# Altium schematic sheet GALX4-0047N_PCB-1109N_REV-A_io_1.SchDoc
size 431 x 279 mm; SheetNumber: 1; SheetTotal: 1; DocumentName: Sheet1.SCHDOC
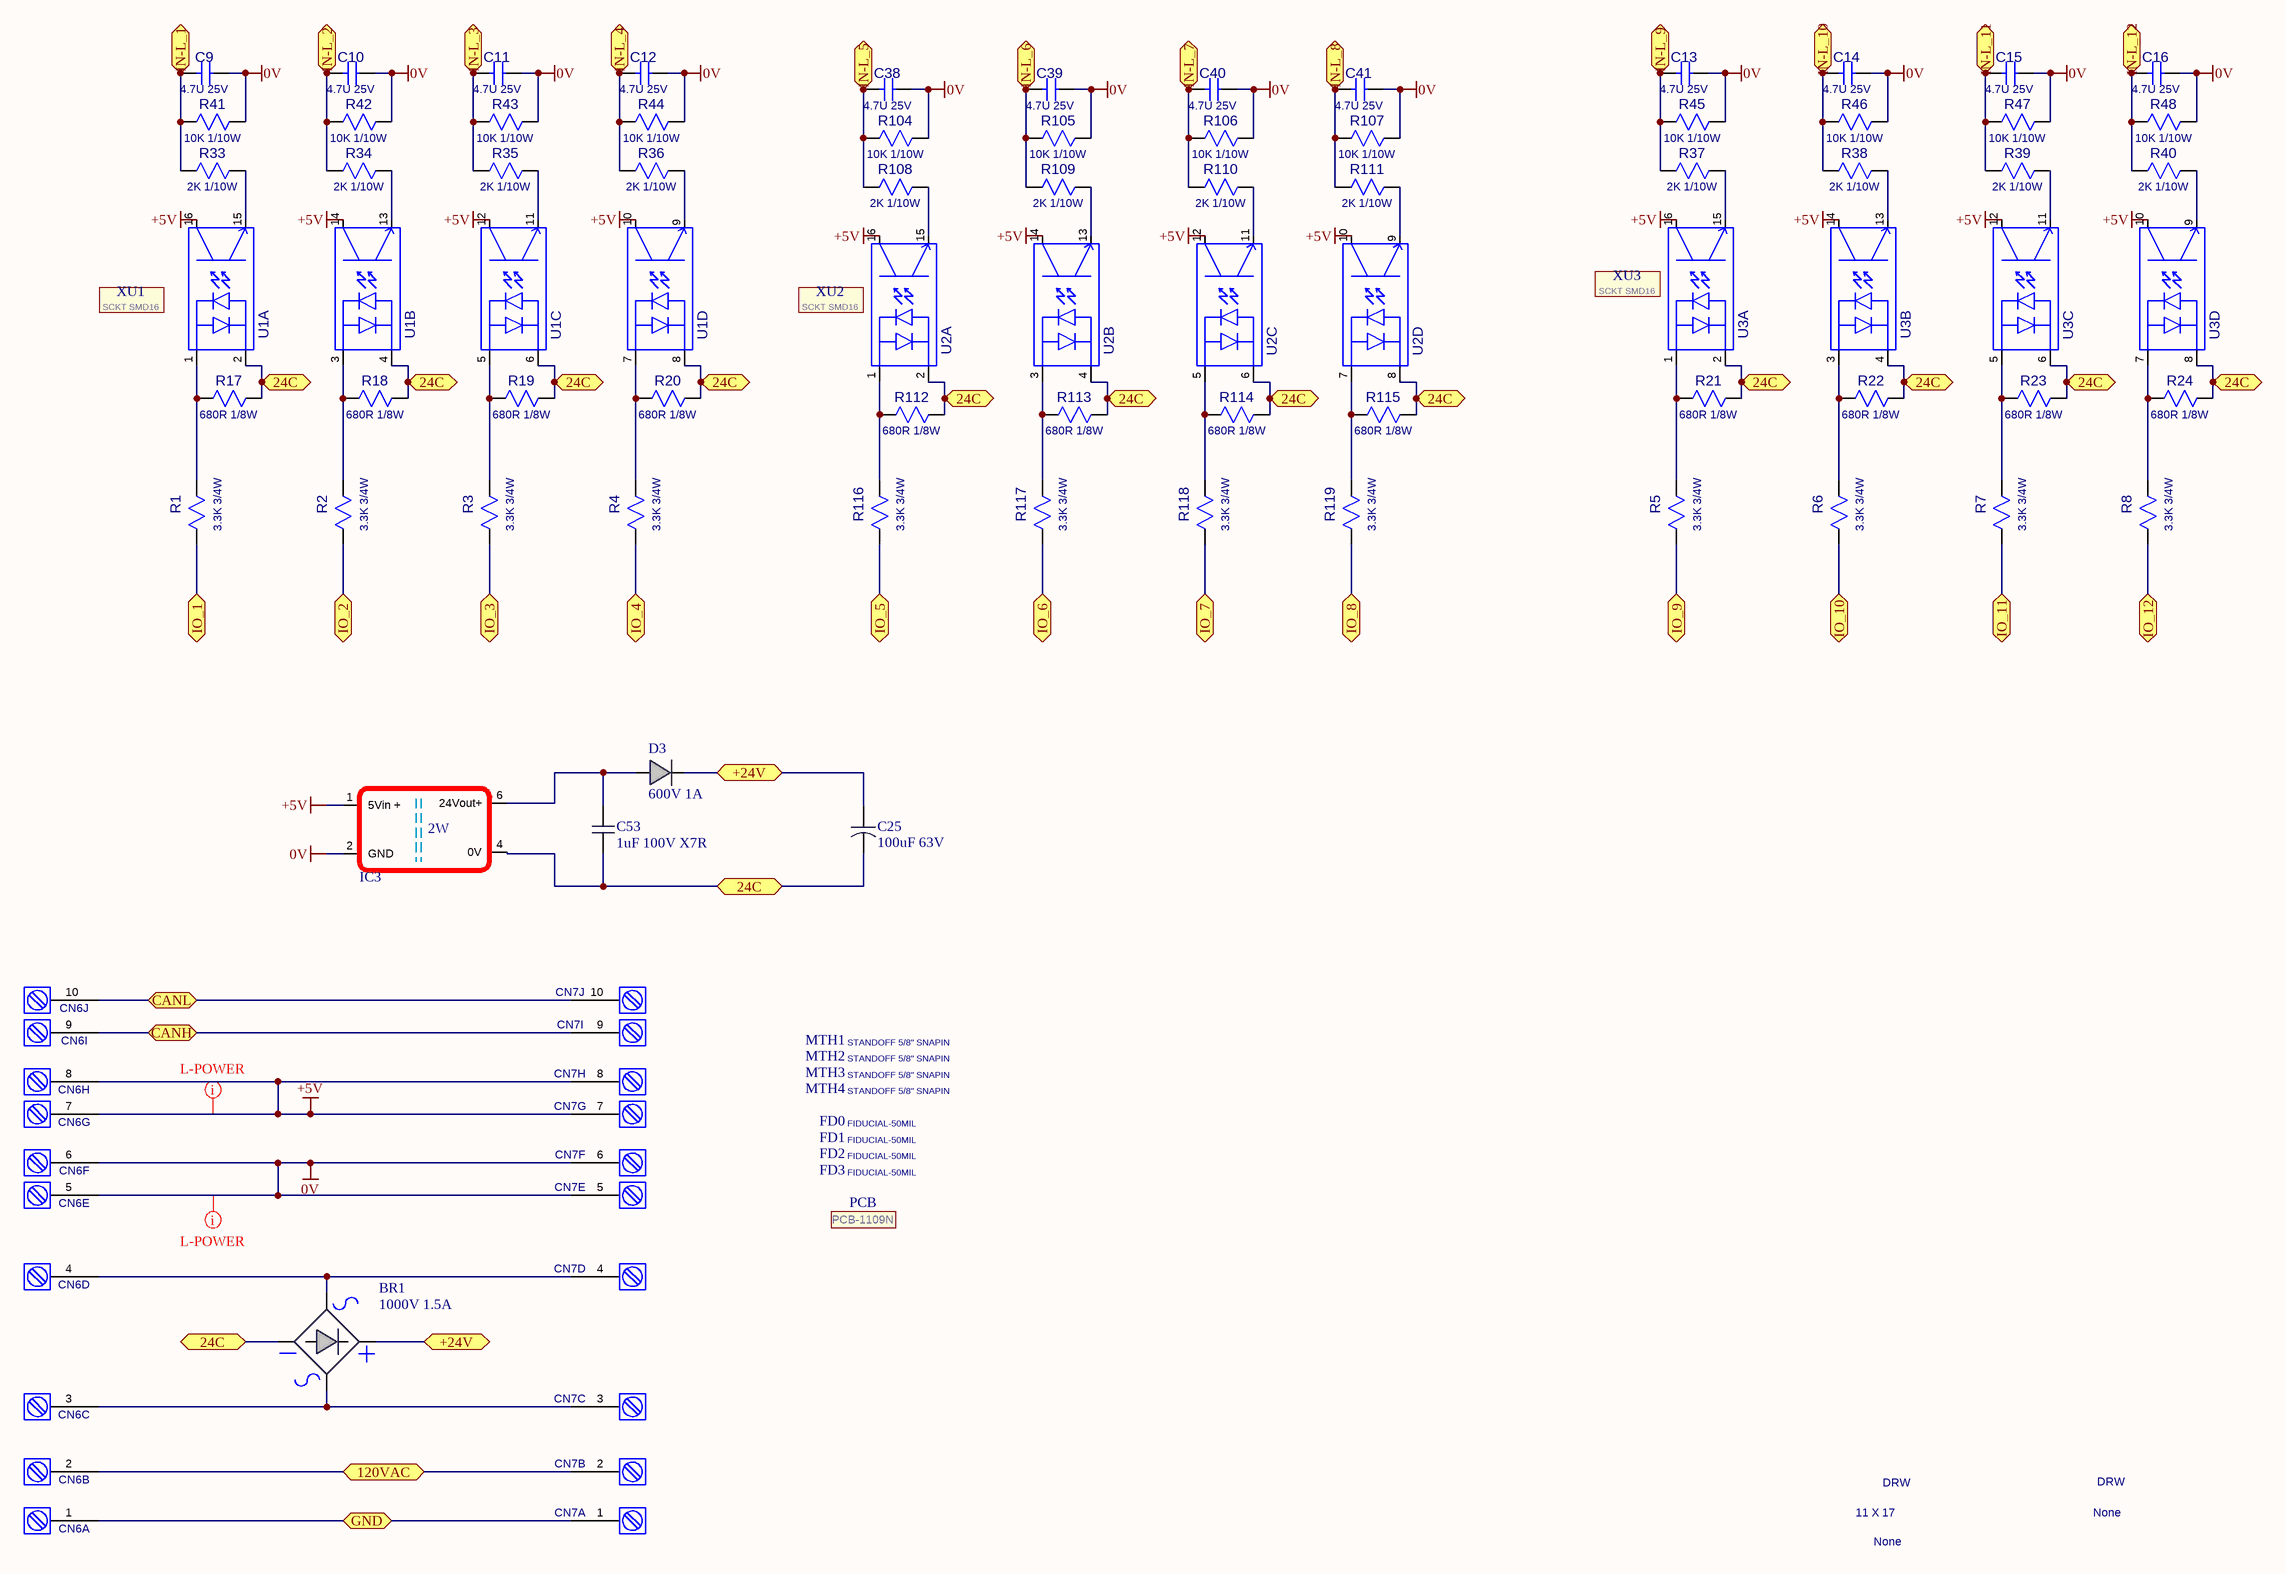
[diagram p0: GALX4-0047N_PCB-1109N_REV-A_io_1.SchDoc]

## Parts
BR1  1000V 1.5A  [SDIP4]
C9  value 4.7U 25V  [0805]  (hidden comment: CAP-0098N)
C10  value 4.7U 25V  [0805]  (hidden comment: CAP-0098N)
C11  value 4.7U 25V  [0805]  (hidden comment: CAP-0098N)
C12  value 4.7U 25V  [0805]  (hidden comment: CAP-0098N)
C13  value 4.7U 25V  [0805]  (hidden comment: CAP-0098N)
C14  value 4.7U 25V  [0805]  (hidden comment: CAP-0098N)
C15  value 4.7U 25V  [0805]  (hidden comment: CAP-0098N)
C16  value 4.7U 25V  [0805]  (hidden comment: CAP-0098N)
C25  100uF 63V  [D10.3]
C38  value 4.7U 25V  [0805]  (hidden comment: CAP-0098N)
C39  value 4.7U 25V  [0805]  (hidden comment: CAP-0098N)
C40  value 4.7U 25V  [0805]  (hidden comment: CAP-0098N)
C41  value 4.7U 25V  [0805]  (hidden comment: CAP-0098N)
C53  1uF 100V X7R  [1206 - CAP]
CN6  CONN-0193N  [CN_150_10P_VERT]  (value not drawn)  (parts A,B,C,D,E,F,G,H,I,J of 10)
CN7  CONN-0193N  [CN_150_10P_VERT]  (value not drawn)  (parts A,B,C,D,E,F,G,H,I,J of 10)
D3  600V 1A  [SMA]
FD0  FIDUCIAL-50MIL  [FIDUCIAL-50MIL]  (no BOM)
FD1  FIDUCIAL-50MIL  [FIDUCIAL-50MIL]  (no BOM)
FD2  FIDUCIAL-50MIL  [FIDUCIAL-50MIL]  (no BOM)
FD3  FIDUCIAL-50MIL  [FIDUCIAL-50MIL]  (no BOM)
IC3  PDM2-S5-S24-S  [PDM2-S5-S24-S]  (value not drawn)
MTH1  value STANDOFF 5/8" SNAPIN  [STANDOFF-8-5/8"]  (hidden comment: HWPC-0018N)
MTH2  value STANDOFF 5/8" SNAPIN  [STANDOFF-8-5/8"]  (hidden comment: HWPC-0018N)
MTH3  value STANDOFF 5/8" SNAPIN  [STANDOFF-8-5/8"]  (hidden comment: HWPC-0018N)
MTH4  value STANDOFF 5/8" SNAPIN  [STANDOFF-8-5/8"]  (hidden comment: HWPC-0018N)
PCB  GAL P/N: PCB-1109N  (hidden comment: PCB)  (mechanical)
R1  value 3.3K 3/4W  [2010]  (hidden comment: RES-0348N)
R2  value 3.3K 3/4W  [2010]  (hidden comment: RES-0348N)
R3  value 3.3K 3/4W  [2010]  (hidden comment: RES-0348N)
R4  value 3.3K 3/4W  [2010]  (hidden comment: RES-0348N)
R5  value 3.3K 3/4W  [2010]  (hidden comment: RES-0348N)
R6  value 3.3K 3/4W  [2010]  (hidden comment: RES-0348N)
R7  value 3.3K 3/4W  [2010]  (hidden comment: RES-0348N)
R8  value 3.3K 3/4W  [2010]  (hidden comment: RES-0348N)
R17  value 680R 1/8W  [0805]  (hidden comment: RES-0338N)
R18  value 680R 1/8W  [0805]  (hidden comment: RES-0338N)
R19  value 680R 1/8W  [0805]  (hidden comment: RES-0338N)
R20  value 680R 1/8W  [0805]  (hidden comment: RES-0338N)
R21  value 680R 1/8W  [0805]  (hidden comment: RES-0338N)
R22  value 680R 1/8W  [0805]  (hidden comment: RES-0338N)
R23  value 680R 1/8W  [0805]  (hidden comment: RES-0338N)
R24  value 680R 1/8W  [0805]  (hidden comment: RES-0338N)
R33  value 2K 1/10W  [0603]  (hidden comment: RES-0315N)
R34  value 2K 1/10W  [0603]  (hidden comment: RES-0315N)
R35  value 2K 1/10W  [0603]  (hidden comment: RES-0315N)
R36  value 2K 1/10W  [0603]  (hidden comment: RES-0315N)
R37  value 2K 1/10W  [0603]  (hidden comment: RES-0315N)
R38  value 2K 1/10W  [0603]  (hidden comment: RES-0315N)
R39  value 2K 1/10W  [0603]  (hidden comment: RES-0315N)
R40  value 2K 1/10W  [0603]  (hidden comment: RES-0315N)
R41  value 10K 1/10W  [0603]  (hidden comment: RES-0314N)
R42  value 10K 1/10W  [0603]  (hidden comment: RES-0314N)
R43  value 10K 1/10W  [0603]  (hidden comment: RES-0314N)
R44  value 10K 1/10W  [0603]  (hidden comment: RES-0314N)
R45  value 10K 1/10W  [0603]  (hidden comment: RES-0314N)
R46  value 10K 1/10W  [0603]  (hidden comment: RES-0314N)
R47  value 10K 1/10W  [0603]  (hidden comment: RES-0314N)
R48  value 10K 1/10W  [0603]  (hidden comment: RES-0314N)
R104  value 10K 1/10W  [0603]  (hidden comment: RES-0314N)
R105  value 10K 1/10W  [0603]  (hidden comment: RES-0314N)
R106  value 10K 1/10W  [0603]  (hidden comment: RES-0314N)
R107  value 10K 1/10W  [0603]  (hidden comment: RES-0314N)
R108  value 2K 1/10W  [0603]  (hidden comment: RES-0315N)
R109  value 2K 1/10W  [0603]  (hidden comment: RES-0315N)
R110  value 2K 1/10W  [0603]  (hidden comment: RES-0315N)
R111  value 2K 1/10W  [0603]  (hidden comment: RES-0315N)
R112  value 680R 1/8W  [0805]  (hidden comment: RES-0338N)
R113  value 680R 1/8W  [0805]  (hidden comment: RES-0338N)
R114  value 680R 1/8W  [0805]  (hidden comment: RES-0338N)
R115  value 680R 1/8W  [0805]  (hidden comment: RES-0338N)
R116  value 3.3K 3/4W  [2010]  (hidden comment: RES-0348N)
R117  value 3.3K 3/4W  [2010]  (hidden comment: RES-0348N)
R118  value 3.3K 3/4W  [2010]  (hidden comment: RES-0348N)
R119  value 3.3K 3/4W  [2010]  (hidden comment: RES-0348N)
U1  IC-0068N  [DIP16FORSMD]  (value not drawn)  (parts A,B,C,D of 4)
U2  IC-0068N  [DIP16FORSMD]  (value not drawn)  (parts A,B,C,D of 4)
U3  IC-0068N  [DIP16FORSMD]  (value not drawn)  (parts A,B,C,D of 4)
XU1  value SCKT SMD16  [SCKT-SMD16]  (hidden comment: SCKT-0029N)
XU2  value SCKT SMD16  [SCKT-SMD16]  (hidden comment: SCKT-0029N)
XU3  value SCKT SMD16  [SCKT-SMD16]  (hidden comment: SCKT-0029N)

## Ports
24C, 120VAC (bidir), +24V, CANH, CANL, GND, IN-L_1, IN-L_2, IN-L_3, IN-L_4, IN-L_5, IN-L_6, IN-L_7, IN-L_8, IN-L_9 (bidir), IN-L_10 (bidir), IN-L_11 (bidir), IN-L_12 (bidir), IO_1, IO_2, IO_3, IO_4, IO_5, IO_6, IO_7, IO_8, IO_9 (bidir), IO_10 (bidir), IO_11 (bidir), IO_12 (bidir)

## Nets
0V: C9.2(B) C10.2(B) C11.2(B) C12.2(B) C13.2(B) C14.2(B) C15.2(B) C16.2(B) C38.2(B) C39.2(B) C40.2(B) C41.2(B) CN6.5 CN6.6 CN7.5 CN7.6 IC3.2(GND) R41.2 R42.2 R43.2 R44.2 R45.2 R46.2 R47.2 R48.2 R104.2 R105.2 R106.2 R107.2
+5V: CN6.7 CN6.8 CN7.7 CN7.8 IC3.1(5Vin_+) U1.10 U1.12 U1.14 U1.16 U2.10 U2.12 U2.14 U2.16 U3.10 U3.12 U3.14 U3.16
24C: BR1.2(-) C25.2 C53.1(A) IC3.4(0V) R17.2 R18.2 R19.2 R20.2 R21.2 R22.2 R23.2 R24.2 R112.2 R113.2 R114.2 R115.2 U1.2 U1.4 U1.6 U1.8 U2.2 U2.4 U2.6 U2.8 U3.2 U3.4 U3.6 U3.8 ; port 24C
120VAC: CN6.2 CN7.2 ; port 120VAC
+24V: BR1.1(+) C25.1 D3.2 ; port +24V
CANH: CN6.9 CN7.9 ; port CANH
CANL: CN6.10 CN7.10 ; port CANL
GND: CN6.1 CN7.1 ; port GND
IN-L_1: C9.1(A) R33.1 R41.1 ; port IN-L_1
IN-L_2: C10.1(A) R34.1 R42.1 ; port IN-L_2
IN-L_3: C11.1(A) R35.1 R43.1 ; port IN-L_3
IN-L_4: C12.1(A) R36.1 R44.1 ; port IN-L_4
IN-L_5: C38.1(A) R104.1 R108.1 ; port IN-L_5
IN-L_6: C39.1(A) R105.1 R109.1 ; port IN-L_6
IN-L_7: C40.1(A) R106.1 R110.1 ; port IN-L_7
IN-L_8: C41.1(A) R107.1 R111.1 ; port IN-L_8
IN-L_9: C13.1(A) R37.1 R45.1 ; port IN-L_9
IN-L_10: C14.1(A) R38.1 R46.1 ; port IN-L_10
IN-L_11: C15.1(A) R39.1 R47.1 ; port IN-L_11
IN-L_12: C16.1(A) R40.1 R48.1 ; port IN-L_12
IO_1: R1.1 ; port IO_1
IO_2: R2.1 ; port IO_2
IO_3: R3.1 ; port IO_3
IO_4: R4.1 ; port IO_4
IO_5: R116.1 ; port IO_5
IO_6: R117.1 ; port IO_6
IO_7: R118.1 ; port IO_7
IO_8: R119.1 ; port IO_8
IO_9: R5.1 ; port IO_9
IO_10: R6.1 ; port IO_10
IO_11: R7.1 ; port IO_11
IO_12: R8.1 ; port IO_12
NetBR1_3: BR1.3(AC_1) CN6.4 CN7.4
NetBR1_4: BR1.4(AC_2) CN6.3 CN7.3
NetC53_2: C53.2(B) D3.1 IC3.6(24Vout+)
NetR1_2: R1.2 R17.1 U1.1
NetR2_2: R2.2 R18.1 U1.3
NetR3_2: R3.2 R19.1 U1.5
NetR4_2: R4.2 R20.1 U1.7
NetR5_2: R5.2 R21.1 U3.1
NetR6_2: R6.2 R22.1 U3.3
NetR7_2: R7.2 R23.1 U3.5
NetR8_2: R8.2 R24.1 U3.7
NetR33_2: R33.2 U1.15
NetR34_2: R34.2 U1.13
NetR35_2: R35.2 U1.11
NetR36_2: R36.2 U1.9
NetR37_2: R37.2 U3.15
NetR38_2: R38.2 U3.13
NetR39_2: R39.2 U3.11
NetR40_2: R40.2 U3.9
NetR108_2: R108.2 U2.15
NetR109_2: R109.2 U2.13
NetR110_2: R110.2 U2.11
NetR111_2: R111.2 U2.9
NetR112_1: R112.1 R116.2 U2.1
NetR113_1: R113.1 R117.2 U2.3
NetR114_1: R114.1 R118.2 U2.5
NetR115_1: R115.1 R119.2 U2.7

## Layout directives
net class L-POWER: 0V, +5V

## Notes on the sheet
- DRW
- 11 X 17
- None
- TITLE:
- S
- DWG BY
- E
- L
- V
- A
- T
- O
- R
- D
- I
- C
- 50 EAST 153rd STREET
- ENGINEER
- DWG. No.
- BRONX, N.Y. 10451
- REV
- DESCRIPTION
- ECN NO.
- DATE
- SIZE
- SCALE
- PART No.
- FILE NAME
- SHEET __ 0F __
- REV.
- (in symbol IC-PDM2-S5-S24-S) 2W

## Library data of the parts
BR1 = DIOD-0081N: DIODE,RECT BRIDGE 1000V 1.5A 4SDIP SMT; MANUFACTURER: FAIRCHILD; MFG PART ID: DF10S; PLACE: S; UNIT $: 0.1144; Value: 1000V 1.5A BR; CERTIFICATES/APPROVALS: UL #E111753 and E326243.; GAL DESC.: DIODE,RECT BRIDGE 1000V 1.5A 4SDIP SMT; GAL P/N: DIOD-0081N; PART TYPE: SDIP4; TEMPERATURE: -55 to +150 C; RoHs COMPLIANT: YES
C9-C16 C38-C41 = CAP-0098N: C-0805-D-4.7U-25V-10%; MANUFACTURER: MURATA; MFG PART ID: GRM21BR61E475KA12L; GAL DESC.: CAP 4.7UF 25V 10% CERM 0805 SMT; PLACE: S; UNIT $: $0.0520; GAL P/N: CAP-0098N; PART TYPE: 0805-050; VENDOR: *; VENDOR ID: *
C25 = CAP-0104N: CAP, 100UF 63V ELECT 20% 10.3MM SMT; MANUFACTURER: UNITED CHEMICON; MFG PART ID: EMVE630ADA101MJA0G; PLACE: S; UNIT $: 0.3; GAL DESC.: CAP, 100UF 63V ELECT 20% 10.3MM SMT; GAL P/N: CAP-0104N; PART TYPE: D10.3; TEMPERATURE: -40°C ~ 105°C; Value: 100uF 63V
C53 = CAP-0110N: CAP, 1UF 100V 10% X7R CERM 1206 SMT; MANUFACTURER: MURATA; MFG PART ID: GRM31CR72A105KA01L; PLACE: S; UNIT $: 0.12016; GAL DESC.: CAP, 1UF 100V 10% X7R CERM 1206 SMT; GAL P/N: CAP-0110N; PART TYPE: 1206; RoHs COMPLIANT: YES; TEMPERATURE: -55°C ~ 125°C; Value: 1uF 100V X7R
CN6 CN7 = CONN-0193N: CN_150_10P_VERT; MANUFACTURER: PHOENIX; Value: 250V 8A; VENDOR ID: 1803507; GAL DESC.: CONN,HEADER 10 POS PCB TERMINAL 3.81 MM; PLACE: M; UNIT $: $0.8500; VENDOR: SAGER; GAL P/N: CONN-0193N; PART TYPE: CONN-0193N; MFG PART ID: 1803507
D3 = DIOD-0077N: DIODE,FAST 600V 1A SMA SMT; MANUFACTURER: STMICRO; MFG PART ID: STTH1L06A; PLACE: S; UNIT $: 0.102; CERTIFICATES/APPROVALS: Epoxy meets UL 94, V0; GAL DESC.: DIODE,FAST 600V 1A SMA SMT; GAL P/N: DIOD-0077N; PART TYPE: SMA; TEMPERATURE: -65°C ~ 175°C; Value: 600V 1A
IC3 = IC-PDM2-S5-S24-S: CONV DC/DC 2W  5 --> 24V OUT SIP4; MANUFACTURER: CUI INC; CERTIFICATES/APPROVALS: UL; GAL DESC.: CONV DC/DC 2W SGL 5V-->24V OUT SIP4; PLACE: M; UNIT $: 4.57; Value: 5V to 24V 2W Boost; HelpURL: http://www.cui.com/product/resource/pdm2-s.pdff; MFG PART ID: PDM2-S5-S24-S; PART TYPE: SIP 4 MODULE; RoHs COMPLIANT: YES; TEMPERATURE: -40°C ~ 85°C
MTH1-MTH4 = HWPC-0018N: STANDOFF-5/8-SNAP; MANUFACTURER: KEYSTONE; MFG PART ID: 8842; UNIT $: $0.0773; PLACE: PW; GAL DESC.: STANDOFF,SNAP IN NYLON 5/8" LG; VENDOR: *; PART TYPE: HWPC-0018N; GAL P/N: HWPC-0018N; VENDOR ID: *
PCB = PCB: PCB-0205N; MANUFACTURER: CIRCUIT ENG; MFG PART ID: PCB-0176N; UNIT $: $5.0000; PLACE: M; GAL DESC.: PCB, GALX-1078AN REV B; VENDOR: *; PART TYPE: PCB; VENDOR ID: *
R1-R8 R116-R119 = RES-0348N: R-2010-B-3.3K-3/4-5%; MANUFACTURER: KOA SPEER; MFG PART ID: RK73B2HTTE332J; PLACE: S; GAL DESC.: RES, 3.3KOHM 3/4W 5% 2010 SMT; UNIT $: $0.0050; GAL P/N: RES-0348N; PART TYPE: 2010; VENDOR: *; VENDOR ID: *
R17-R24 R112-R115 = RES-0338N: R-0805-A-680R-1/8-5%; MANUFACTURER: YAGEO; MFG PART ID: RC0805JR-07680RL; PLACE: S; GAL DESC.: RES, 680 OHM 1/8W 5% 0805 SMT; UNIT $: $0.0038; GAL P/N: RES-0338N; PART TYPE: 0805; VENDOR: *; VENDOR ID: *
R33-R40 R108-R111 = RES-0315N: R-0603-B-2.0K-1/10-5%; MANUFACTURER: PANASONIC-ECG; MFG PART ID: ERJ-3GEYJ202V; PLACE: S; GAL DESC.: RES, 2.0KOHM 1/10W 5% 0603 SMT; UNIT $: $0.0024; GAL P/N: RES-0315N; PART TYPE: 0603; VENDOR: *; VENDOR ID: *
R41-R48 R104-R107 = RES-0314N: R-0603-B-10.0K-1/10-5%; MANUFACTURER: PANASONIC-ECG; MFG PART ID: ERJ-3GEYJ103V; PLACE: S; GAL DESC.: RES, 10.0KOHM 1/10W 5% 0603 SMT; UNIT $: $0.0024; GAL P/N: RES-0314N; PART TYPE: 0603; VENDOR: *; VENDOR ID: *
U1-U3 = IC-0068N: LTV-844-DIP16; MANUFACTURER: LITE-ON; GAL DESC.: IC,OPTOISOLATOR 4CH AC-IN 16PIN DIP; UNIT $: $0.6477; PLACE: D; REPAIR: -00002; SLOT: 00337; Value: IC-0068N; GAL P/N: IC-0068N; VENDOR ID: *; VENDOR: *; MFG PART ID: LTV-844; PART TYPE: DIP16; DEPTH: +00001
XU1-XU3 = SCKT-0029N: SOCKET_SMD16; MANUFACTURER: MILL-MAX; MFG PART ID: 214-44-316-01-670800; UNIT $: $0.8000; PLACE: S; GAL DESC.: SOCKET,16 PIN CLOSED FRAME 16SMD SMT; VENDOR: *; PART TYPE: SCKT_SMD16; GAL P/N: SCKT-0029N; VENDOR ID: *
FD0-FD3 = FIDUCIAL-50MIL: MANUFACTURER: *; VENDOR: *; PART TYPE: *; UNIT $: *; MFG PART ID: *; PLACE: *; GAL P/N: *; VENDOR ID: *; GAL DESC.: FIDUCIAL; Value: FIDUCIAL-50MIL